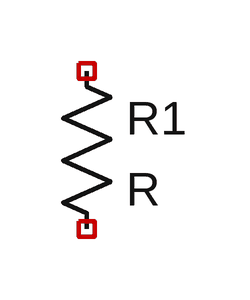
[diagram p0: schematic rf-tuning.asc]
rf-tuning.asc, the LTspice schematic file:
Version 4.1
SHEET 1 880 680
SYMBOL res 96 96 R0
SYMATTR InstName R1

The netlist it stands for:
* rf-tuning.asc
R1 NC_01 NC_02 R
.backanno
.end